# EAGLE schematic BOOSTDCDC_BATT (1) (EAGLE 9.5.2)
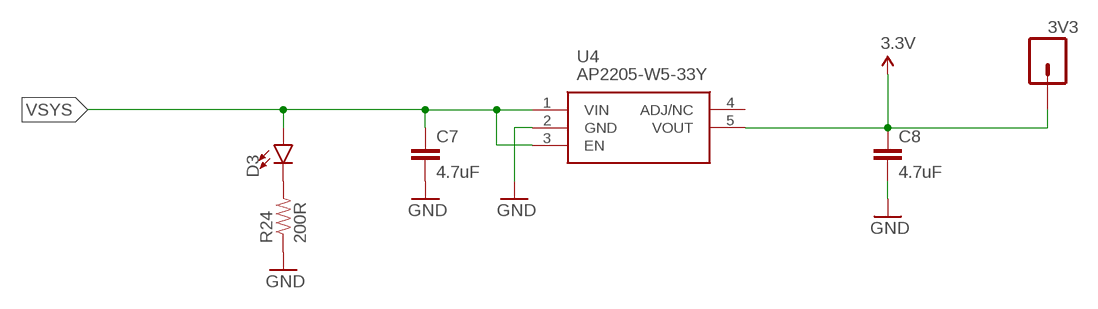
[diagram p0: schematic, sheet 1, part 1 of 3]
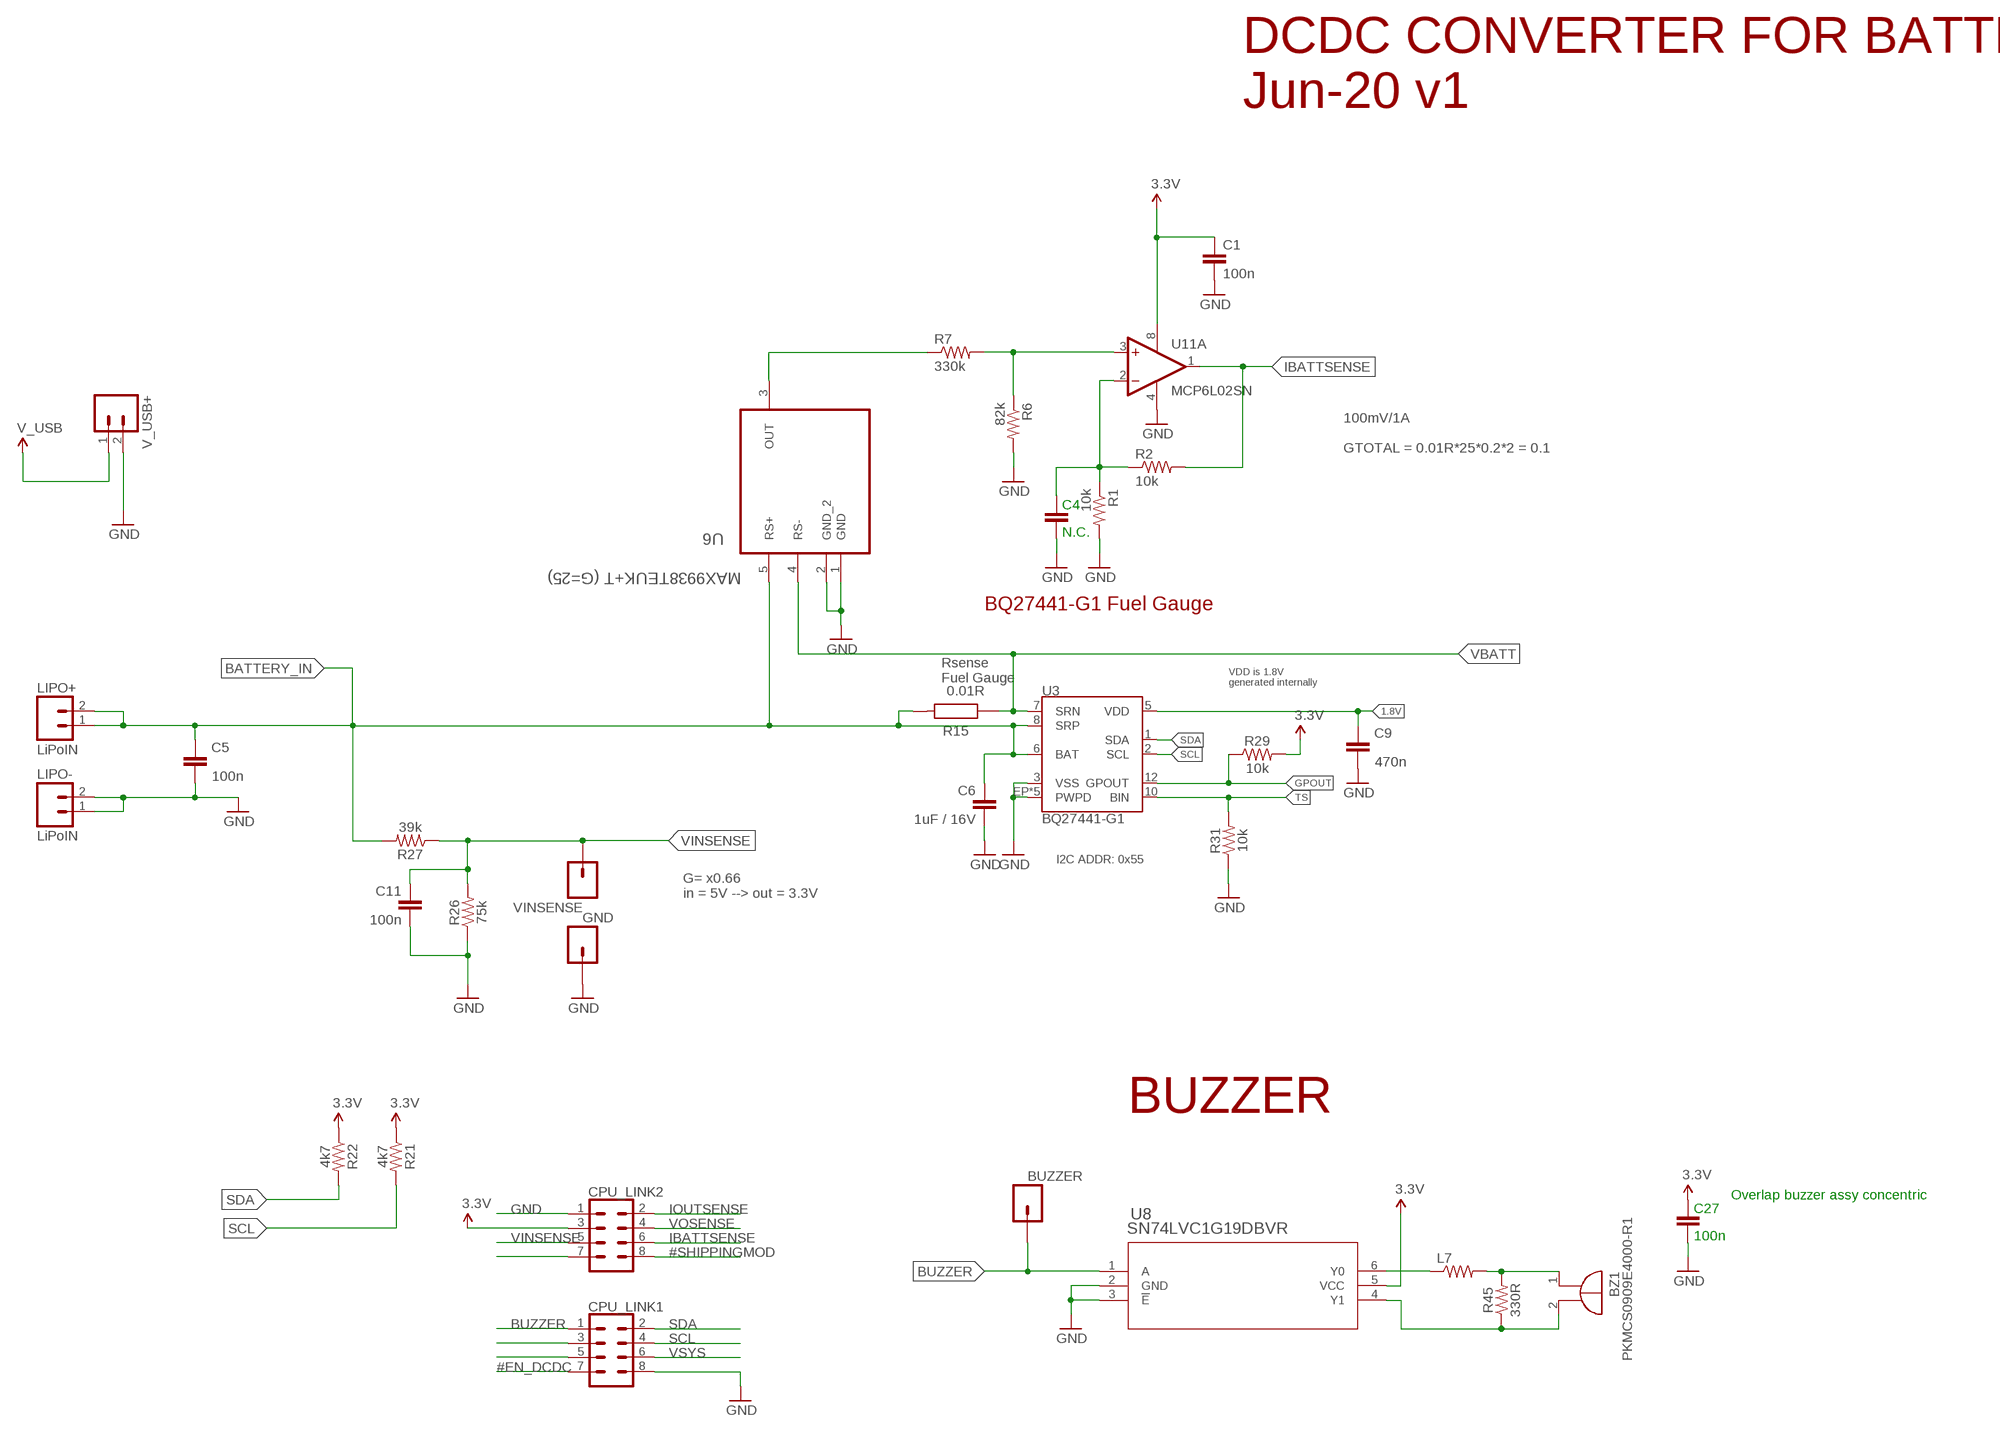
[diagram p1: schematic, sheet 1, part 2 of 3]
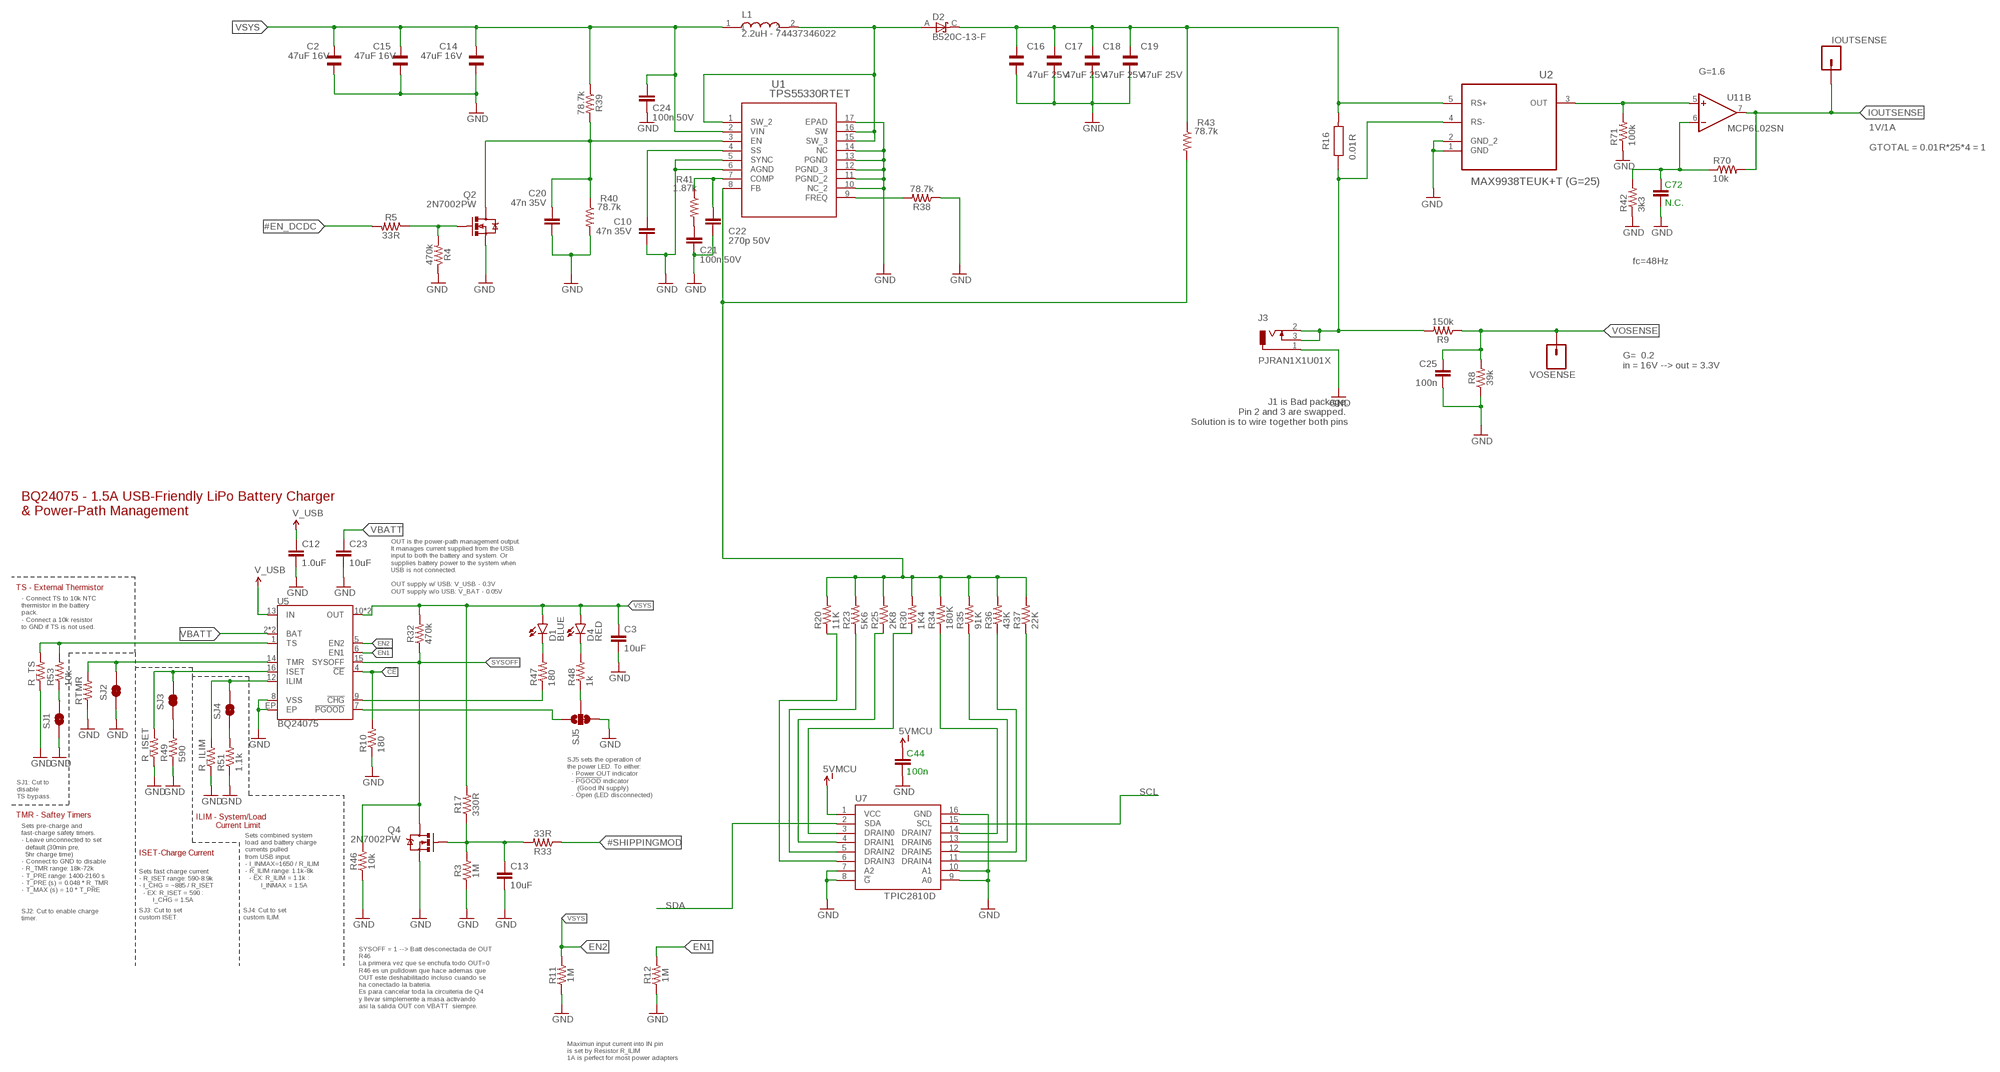
[diagram p2: schematic, sheet 1, part 3 of 3]

## Parts
3V3  M01PTH_2MM  [1X01_2MM]
BUZZER  M01PTH_2MM  [1X01_2MM]
BZ1  PKMCS0909E4000-R1  [PKMCS0909]
C1  100n  CAP0805  [0805]
C2  47uF 16V  WCAP-CSGP_1210_885012109003  [WCAP-CSGP_1210]
C3  10uF  10UF10V10%(0805)  [0805-CAP]
C4  N.C.  CAP0805  [0805]
C5  100n  10UF-0805-25V-10%  [0805@1]
C6  1uF / 16V  10UF-0805-25V-10%  [0805@1]
C7  4.7uF  CAPACITOR-N0805  [0805]
C8  4.7uF  CAPACITOR-N0805  [0805]
C9  470n  10UF-0805-25V-10%  [0805@1]
C10  47n 35V  10UF-0805-25V-10%  [0805@1]
C11  100n  10UF-0805-25V-10%  [0805@1]
C12  1.0uF  1.0UF50V10%(1206)  [1206-CAP]
C13  10uF  10UF10V10%(0805)  [0805-CAP]
C14  47uF 16V  WCAP-CSGP_1210_885012109003  [WCAP-CSGP_1210]
C15  47uF 16V  WCAP-CSGP_1210_885012109003  [WCAP-CSGP_1210]
C16  47uF 25V  WCAP-CSGP_1210_885012109003  [WCAP-CSGP_1210]
C17  47uF 25V  WCAP-CSGP_1210_885012109003  [WCAP-CSGP_1210]
C18  47uF 25V  WCAP-CSGP_1210_885012109003  [WCAP-CSGP_1210]
C19  47uF 25V  WCAP-CSGP_1210_885012109003  [WCAP-CSGP_1210]
C20  47n 35V  10UF-0805-25V-10%  [0805@1]
C21  100n 50V  10UF-0805-25V-10%  [0805@1]
C22  270p 50V  10UF-0805-25V-10%  [0805@1]
C23  10uF  10UF10V10%(0805)  [0805-CAP]
C24  100n 50V  10UF-0805-25V-10%  [0805@1]
C25  100n  10UF-0805-25V-10%  [0805@1]
C27  100n  CAP0805  [0805]
C44  100n  CAP0805  [0805]
C72  N.C.  CAP0805  [0805]
CPU_LINK1  CONN_04X2  [2X4]
CPU_LINK2  CONN_04X2  [2X4]
D1  BLUE  LED-BLUE0603  [LED-0603]
D2  B520C-13-F  [DIOM7959X250N]
D3  LED3MM  [LED_3MM]
D4  RED  LED-RED0603  [LED-0603]
GND  M01PTH_2MM  [1X01_2MM]
IOUTSENSE  M01PTH_2MM  [1X01_2MM]
J3  PJRAN1X1U01X  [PJRAN1X1U01X]
L1  2.2uH - 74437346022  74437349100  [INDM7366X500]
L7  MMZ2012Y202BT000  RESISTOR0805-RES  [0805]
LIPO+  LiPoIN  M02PTH  [1X02]
LIPO-  LiPoIN  M02PTH  [1X02]
Q2  2N7002PW  MOSFET-NCHANNEL2N7002PW  [SOT323]
Q4  2N7002PW  MOSFET-NCHANNEL2N7002PW  [SOT323]
R1  10k  RESISTOR0805-RES  [0805]
R2  10k  RESISTOR0805-RES  [0805]
R3  1M  RESISTOR0805  [0805]
R4  470k  RESISTOR0805  [0805]
R5  33R  RESISTOR0805  [0805]
R6  82k  RESISTOR0805-RES  [0805]
R7  330k  RESISTOR0805-RES  [0805]
R8  39k  RESISTOR0805  [0805]
R9  150k  RESISTOR0805  [0805]
R10  180  RESISTOR0805-RES  [0805]
R11  1M  RESISTOR0805  [0805]
R12  1M  RESISTOR0805  [0805]
R15  0.01R  WRIS-KWKH_0612_561070332051  [WRIS-KWKH_0612]
R16  0.01R  WRIS-KWKH_0612_561070332051  [WRIS-KWKH_0612]
R17  330R  RESISTOR0805  [0805]
R20  11K  RESISTOR0805-RES  [0805]
R21  4k7  RESISTOR0805  [0805]
R22  4k7  RESISTOR0805  [0805]
R23  5K6  RESISTOR0805-RES  [0805]
R24  200R  RESISTOR0805-RES  [0805]
R25  2K8  RESISTOR0805-RES  [0805]
R26  75k  RESISTOR0805  [0805]
R27  39k  RESISTOR0805  [0805]
R29  10k  RESISTOR0805  [0805]
R30  1K4  RESISTOR0805-RES  [0805]
R31  10k  RESISTOR0805  [0805]
R32  470k  RESISTOR0805  [0805]
R33  33R  RESISTOR0805  [0805]
R34  180K  RESISTOR0805-RES  [0805]
R35  91K  RESISTOR0805-RES  [0805]
R36  43K  RESISTOR0805-RES  [0805]
R37  22K  RESISTOR0805-RES  [0805]
R38  78.7k  RESISTOR0805  [0805]
R39  78.7k  RESISTOR0805  [0805]
R40  78.7k  RESISTOR0805  [0805]
R41  1.87k  RESISTOR0805  [0805]
R42  3k3  RESISTOR0805-RES  [0805]
R43  78.7k  RESISTOR0805  [0805]
R45  330R  RESISTOR0805  [0805]
R46  10k  RESISTOR0805  [0805]
R47  180  RESISTOR0805-RES  [0805]
R48  1k  RESISTOR0805-RES  [0805]
R49  590  RESISTOR0805-RES  [0805]
R51  1.1k  RESISTOR0805-RES  [0805]
R53  10k  RESISTOR0805-RES  [0805]
R70  10k  RESISTOR0805-RES  [0805]
R71  100k  RESISTOR0805-RES  [0805]
R_ILIM  RESISTOR0805-RES  [0805]
R_ISET  RESISTOR0805-RES  [0805]
R_TS  RESISTOR0805-RES  [0805]
RTMR  RESISTOR0805-RES  [0805]
SJ1  JUMPER-PAD-2-NC_BY_TRACE  [PAD-JUMPER-2-NC_BY_TRACE_YES_SILK]
SJ2  JUMPER-PAD-2-NC_BY_TRACE  [PAD-JUMPER-2-NC_BY_TRACE_YES_SILK]
SJ3  JUMPER-PAD-2-NC_BY_TRACE  [PAD-JUMPER-2-NC_BY_TRACE_YES_SILK]
SJ4  JUMPER-PAD-2-NC_BY_TRACE  [PAD-JUMPER-2-NC_BY_TRACE_YES_SILK]
SJ5  JUMPER-PAD-3-2OF3_NC_BY_TRACE_SMALL  [PAD-JUMPER-3-2OF3_NC_BY_TRACE_YES_SILK_FULL_BOX]
U1  TPS55330RTET  [RTE16_1P66X1P66_TEX]
U2  MAX9938TEUK+T (G=25)  MAX9938FEUK+T  [SOT95P280X145-5N]
U3  BQ27441-G1  [PDSO-N12]
U4  AP2205-W5-33Y  AP2205-W5-7  [SOT95P282X145-5N]
U5  BQ24075  [PVQFN-N16]
U6  MAX9938TEUK+T (G=25)  MAX9938FEUK+T  [SOT95P280X145-5N]
U7  TPIC2810D  [SO16]
U8  SN74LVC1G19DBVR  [DBV6]
U11  MCP6L02SN  [SO08]
V_USB+  M02PTH  [1X02]
VINSENSE  M01PTH_2MM  [1X01_2MM]
VOSENSE  M01PTH_2MM  [1X01_2MM]

## Nets
1.8V: C9.1 U3.5(VDD)
3.3V: 3V3.1 C1.1 C8.1 C27.2 CPU_LINK2.3 R21.1 R22.1 R29.2 U4.5(VOUT) U8.5(VCC) U11.8(P:V+)
!CE!: R10.2 U5.4(!CE!)
!CHG!: R47.1 U5.9(!CHG!)
!PGOOD!: SJ5.1 U5.7(!PGOOD!)
#EN_DCDC: CPU_LINK1.7 R5.2
#SHIPPINGMOD: CPU_LINK2.8 R33.1
BATTERY_IN: C5.1 C6.1 LIPO+.1 LIPO+.2 R15.2 R27.2 U3.6(BAT) U3.8(SRP) U6.5(RS+)
BUZZER: BUZZER.1 CPU_LINK1.1 U8.1(A)
EN1: R12.2 U5.6(EN1)
EN2: R11.2 U5.5(EN2)
GND: C1.2 C2.1 C3.2 C4.1 C5.2 C6.2 C7.2 C8.2 C9.2 C10.2 C11.2 C12.2 C13.2 C14.1 C15.1 C16.1 C17.1 C18.1 C19.1 C20.2 C21.1 C22.1 C23.2 C24.1 C25.2 C27.1 C44.1 C72.1 CPU_LINK1.8 CPU_LINK2.1 GND.1 J3.1 LIPO-.1 LIPO-.2 Q2.2(S) Q4.2(S) R1.2 R3.1 R4.1 R6.2 R8.1 R10.1 R11.1 R12.1 R24.1 R26.1 R31.1 R38.1 R40.2 R42.1 R46.1 R49.1 R51.1 R71.1 R_ILIM.1 R_ISET.1 R_TS.1 RTMR.1 SJ1.1 SJ2.1 SJ5.3 U1.5(SYNC) U1.6(AGND) U1.10(NC_2) U1.11(PGND_2) U1.12(PGND_3) U1.13(PGND) U1.14(NC) U1.17(EPAD) U2.1(GND) U2.2(GND_2) U3.3(VSS) U3.EP1(PWPD) U3.EP2(PWPD) U3.EP3(PWPD) U3.EP4(PWPD) U3.EP(PWPD) U4.2(GND) U5.8(VSS) U5.EP U6.1(GND) U6.2(GND_2) U7.7(A2) U7.8(!G) U7.9(A0) U7.10(A1) U7.16(GND) U8.2(GND) U8.3(!E) U11.4(P:V-) V_USB+.2
GPOUT: R29.1 U3.12(GPOUT)
IBATTSENSE: CPU_LINK2.6 R2.2 U11.1(A:OUT)
ILIM: R_ILIM.2 SJ4.2 U5.12(ILIM)
IOUTSENSE: CPU_LINK2.2 IOUTSENSE.1 R70.2 U11.7(B:OUT)
ISET: R_ISET.2 SJ3.2 U5.16(ISET)
N$1: D4.C R48.2
N$2: CPU_LINK2.7
N$3: CPU_LINK1.3
N$4: Q2.1(G) R4.2 R5.1
N$5: CPU_LINK1.5
N$6: D1.C R47.2
N$7: R53.1 SJ1.2
N$8: R71.2 U2.3(OUT) U11.5(B:+IN)
N$9: R51.2 SJ4.1
N$10: C4.2 R1.1 R2.1 U11.2(A:-IN)
N$11: R6.1 R7.2 U11.3(A:+IN)
N$13: J3.2 J3.3 R9.2 R16.1 U2.4(RS-)
N$14: R49.2 SJ3.1
N$15: R48.1 SJ5.2
N$16: R20.1 U7.6(DRAIN3)
N$17: L7.1 U8.6(Y0)
N$18: D3.K(C) R24.2
N$19: BZ1.1(+) L7.2 R45.2
N$21: R23.1 U7.5(DRAIN2)
N$22: BZ1.2(-) R45.1 U8.4(Y1)
N$23: C13.1 Q4.1(G) R3.2 R17.1 R33.2
N$24: R25.1 U7.4(DRAIN1)
N$30: R30.1 U7.3(DRAIN0)
N$31: R34.1 U7.14(DRAIN7)
N$32: R35.1 U7.13(DRAIN6)
N$33: R36.1 U7.12(DRAIN5)
N$34: R37.1 U7.11(DRAIN4)
N$35: C10.1 U1.4(SS)
N$36: D2.A L1.2 U1.1(SW_2) U1.15(SW_3) U1.16(SW)
N$37: R38.2 U1.9(FREQ)
N$42: C20.1 Q2.3(D) R39.2 R40.1 U1.3(EN)
N$43: C21.2 R41.2
N$44: C22.2 R41.1 U1.7(COMP)
N$45: R20.2 R23.2 R25.2 R30.2 R34.2 R35.2 R36.2 R37.2 R43.2 U1.8(FB)
N$46: R7.1 U6.3(OUT)
N$77: C72.2 R42.2 R70.1 U11.6(B:-IN)
SCL: CPU_LINK1.4 R21.2 U3.2(SCL) U7.15(SCL)
SDA: CPU_LINK1.2 R22.2 U3.1(SDA) U7.2(SDA)
SYSOFF: Q4.3(D) R32.1 R46.2 U5.15(SYSOFF)
TMR: RTMR.2 SJ2.2 U5.14(TMR)
TS: R31.2 U3.10(BIN)
TS1: R53.2 R_TS.2 U5.1(TS)
V_USB: C12.1 U5.13(IN) V_USB+.1
VBATT: C23.1 R15.1 U3.7(SRN) U5.2(BAT) U5.3(BAT) U6.4(RS-)
VCC-ISO: C44.2 U7.1(VCC) ; supply symbol labelled 5VMCU
VINSENSE: C11.1 CPU_LINK2.5 R26.2 R27.1 VINSENSE.1
VOSENSE: C25.1 CPU_LINK2.4 R8.2 R9.1 VOSENSE.1
VSOURCE: C16.2 C17.2 C18.2 C19.2 D2.C R16.2 R43.1 U2.5(RS+)
VSYS: C2.2 C3.1 C7.1 C14.2 C15.2 C24.2 CPU_LINK1.6 D1.A D3.A D4.A L1.1 R17.2 R32.2 R39.1 U1.2(VIN) U4.1(VIN) U4.3(EN) U5.10(OUT) U5.11(OUT)
Unconnected: U4.4(ADJ/NC)

## Notes on the sheet
- DCDC CONVERTER FOR BATTERY
  Jun-20 v1
- 100mV/1A
  
  GTOTAL = 0.01R*25*0.2*2 = 0.1
- BQ27441-G1 Fuel Gauge
- VDD is 1.8V
  generated internally
- Rsense
  Fuel Gauge
- I2C ADDR: 0x55
- G= x0.66
  in = 5V --> out = 3.3V
- BUZZER
- Overlap buzzer assy concentric
- G=1.6
- 1V/1A
  
  GTOTAL = 0.01R*25*4 = 1
- fc=48Hz
- G=  0.2
  in = 16V --> out = 3.3V
- J1 is Bad package.
  Pin 2 and 3 are swapped. 
  Solution is to wire together both pins
- BQ24075 - 1.5A USB-Friendly LiPo Battery Charger 
  & Power-Path Management
- OUT is the power-path management output.
  It manages current supplied from the USB 
  input to both the battery and system. Or
  supplies battery power to the system when 
  USB is not connected.
  
  OUT supply w/ USB: V_USB - 0.3V
  OUT supply w/o USB: V_BAT - 0.05V
- TS - External Thermistor
- - Connect TS to 10k NTC 
  thermistor in the battery
  pack.
  - Connect a 10k resistor 
  to GND if TS is not used.
- SJ5 sets the operation of 
  the power LED. To either:
    - Power OUT indicator
    - !PGOOD! indicator 
       (Good IN supply)
    - Open (LED disconnected)
- SJ1: Cut to 
  disable
  TS bypass.
- TMR - Saftey Timers
- ILIM - System/Load 
            Current Limit
- Sets pre-charge and
  fast-charge safety timers.
  - Leave unconnected to set
    default (30min pre, 
    5hr charge time)
  - Connect to GND to disable
  - R_TMR range: 18k-72k
  - T_PRE range: 1400-2160 s
  - T_PRE (s) = 0.048 * R_TMR
  - T_MAX (s) = 10 * T_PRE
- Sets combined system
  load and battery charge 
  currents pulled
  from USB input.
  - I_INMAX=1650 / R_ILIM
  - R_ILIM range: 1.1k-8k
    - EX: R_ILIM = 1.1k : 
          I_INMAX = 1.5A
- ISET-Charge Current
- Sets fast charge current
  - R_ISET range: 590-8.9k
  - I_CHG = ~885 / R_ISET
    - EX: R_ISET = 590 : 
         I_CHG = 1.5A
- SJ3: Cut to set
  custom ISET.
- SJ4: Cut to set
  custom ILIM.
- SJ2: Cut to enable charge
  timer.
- SYSOFF = 1 --> Batt desconectada de OUT
  R46
  La primera vez que se enchufa todo OUT=0
  R46 es un pulldown que hace ademas que
  OUT este deshabilitado incluso cuando se
  ha conectado la bateria.
  Es para cancelar toda la circuiteria de Q4
  y llevar simplemente a masa activando
  asi la salida OUT con VBATT  siempre.
- Maximun input current into IN pin
  is set by Resistor R_ILIM
  1A is perfect for most power adapters

## Library data of the parts
3V3 BUZZER GND IOUTSENSE VINSENSE VOSENSE = SparkFun-Connectors:M01: Header 1 Standard 1-pin 0.1" header. Use with straight break away headers (SKU : PRT-00116), right angle break away headers (PRT-00553), swiss pins (PRT-00743), machine pins (PRT-00117), and female headers (PRT-00115).
BZ1 = buzzer:PKMCS0909E4000-R1: PKMCS0909E4000-R1 Source : http://www.murata.com/~/media/webrenewal/products/sound/sounder/vppt-buzj083-d.ashx
C1 = SparkFun-Passives:CAP: Capacitor Standard 0603 ceramic capacitor, and 0.1" leaded capacitor.
C2 C14-C19 = Wurth_Elektronik_Passive_Capacitors_rev19a:WCAP-CSGP_1210: WCAP-CSGP Ceramic Capacitors Characteristics Multilayer Ceramic Chip Capacitor Recommended soldering:Reflow, for 0603 and 0805 wave soldering is also allowed Operating temperature:-55 °C to +125 °C; Ceramic characteristics: Class I - NPO ; Class II -X7R, X5R High performance ceramic High capacitance stability Minimal aging Termination:Cu/Ni/Sn <http://katalog.we-online.de/media/images/eisos/WCAP-CSGP_pf2.jpg> Details see: http://katalog.we-online.de/en/pbs/WCAP-CSGP-1210? Created: 2015-01-28 2015 (C) Wurth Elektronik; WE-NUMBER: 885012109003/47uF
C3 C13 C23 = SparkFun-Capacitors:10UF10V10%(0805): CAP-11330; PROD_ID: CAP-11330
C4 C27 C44 C72 = SparkFun:CAP: Capacitor Standard 0603 ceramic capacitor, and 0.1" leaded capacitor.
C5 C6 C9-C11 C20-C22 C24 C25 = SparkFun-Capacitors:10UF: 10.0µF ceramic capacitors A capacitor is a passive two-terminal electrical component used to store electrical energy temporarily in an electric field.; PROD_ID: CAP-14259; VALUE: 10uF
C7 C8 = BeagleBone_Blue_R3:CAPACITOR-N
C12 = SparkFun-Capacitors:1.0UF50V10%(1206): CAP-09822; PROD_ID: CAP-09822
CPU_LINK1 CPU_LINK2 = SparkFun-Connectors:CONN_04X2: Multi connection point. Often used as Generic Header-pin footprint for 0.1 inch spaced/style header connections On any of the 0.1 inch spaced packages, you can populate with these: Break Away Headers - Straight <https://www.sparkfun.com/products/116> (PRT-00116) Break Away Male Headers - Right Angle <https://www.sparkfun.com/products/553> (PRT-00553) Female Headers <https://www.sparkfun.com/products/115> (PRT-00115) Break Away Headers - Machine Pin <https://www.sparkfun.com/products/117> (PRT-00117) Break Away Female Headers - Swiss Machine Pin <https://www.sparkfun.com/products/743> (PRT-00743)
D1 = SparkFun-LED:LED-BLUE: Blue LEDs for production use Various blue LEDs stocked by SparkFun production 0603 - DIO-08575 Rebel - DIO-09553 1206 - DIO-09911; PROD_ID: DIO-08575
D2 = B520C-13-F:B520C-13-F: 5.0A SURFACE MOUNT SCHOTTKY BARRIER RECTIFIER; AVAILABILITY: Unavailable; DESCRIPTION: Diode Schottky 20V 5A Surface Mount SMC; DIGIKEY-PURCHASE-URL: https://snapeda.com/shop?store=DigiKey&id=325969; MF: Diodes Inc.; MP: B520C-13-F; PACKAGE: DO-214 Diodes Inc.; PRICE: None
D3 = SparkFun-LED:LED: LED (Generic) Standard schematic elements and footprints for 5mm, 3mm, 1206, and 0603 sized LEDs. Generic LEDs with no color specified.; PROD_ID: DIO-08794
D4 = SparkFun-LED:LED-RED: Assorted Red LEDs LilyPad 1206- DIO-09912 1206- DIO-00809 0603- DIO-00819 "SMART" means more efficient and expensive; PROD_ID: DIO-00819
J3 = Connectors:PJRAN1X1U01X: CONN RCA JACK MONO 3.2MM R/A Manufacturer's datasheet <http://www.switchcraft.com/Drawings/pjran1x1u__x_series_cd.pdf>; CREATED_BY: PCBLayout.com; DIGIKEY_PART_NUMBER: PJRAN1X1U01X-ND; MANUFACTURER: Switchcraft Inc.; MPN: PJRAN1X1U01X
L1 = Inductance_2.2uH:74437349100: Inductor, SMD [Würth Elektronik] 74437349100 Inductor, SMD; DESCRIPTION: 10µH Shielded Molded Inductor 3.2A 69mOhm Max Nonstandard; DIGIKEY-PURCHASE-URL: https://snapeda.com/shop?store=DigiKey&id=586788; MF: Wurth Electronics; MP: 74437349100; PACKAGE: Nonstandard Wurth Electronics
L7 R10 R20 R23-R25 R30 R34-R37 R42 R47-R49 R51 R53 R70 R71 R_ILIM R_ISET R_TS RTMR = SparkFun:RESISTOR: Resistor Basic schematic elements and footprints for 0603, 1206, and PTH resistors.
LIPO+ LIPO- V_USB+ = SparkFun:M02: Header 2 Standard 2-pin 0.1" header. Use with straight break away headers (SKU : PRT-00116), right angle break away headers (PRT-00553), swiss pins (PRT-00743), machine pins (PRT-00117), and female headers (PRT-00115). Molex polarized connector foot print use with SKU : PRT-08233 with associated crimp pins and housings.
Q2 Q4 = SparkFun-DiscreteSemi:MOSFET-NCHANNEL: Common NMOSFET Parts MFG P/N Store ID Prod ID FDD8780 TRANS-09984 SI7820DN TRANS-11055 FDS6630A IC-08089 2N7002PW TRANS-11151 FQP30N06L COM-10213 TRANS-10060 BSS123LT1G TRANS-08345 BSS138 TRANS-00830 BS170 2N7000; PROD_ID: TRANS-11151
R1 R2 R6 R7 = SparkFun-Passives:RESISTOR: Resistor Basic schematic elements and footprints for 0603, 1206, and PTH resistors.
R3-R5 R8 R9 R11 R12 R17 R21 R22 R26 R27 R29 R31-R33 R38-R41 R43 R45 R46 = SparkFun-Resistors:RESISTOR: Generic Resistor Package
R15 R16 = Wurth_Resistor_WRIS-KWKH:WRIS-KWKH_0612: WRIS-KWKH Thick Film Resistors High Power Current Sensing, Wide Terminal Characteristics Product series for high power current sensing up to 1 W Mounting style: SMT-Chip (wide terminal) Resistance range: 100 mΩ ‒ 620 Ω Resistance tolerance: ±1% / ±5% Rated Power: 1 W TCR: +200; +250; +350 ppm/°C Operating temperature: -55 °C up to +155 °C Sizes: 0612 / 1020 Recommended soldering: Reflow soldering Applications DC/DC converter Camera Night vision device TV Lighting <https://katalog.we-online.com/media/images/v2/o135742v209%20Family_WRIS-KWKH.jpg> Details see: https://katalog.we-online.com/en/pbs/WRIS-KWKH Created by Ella Wu 2019-09-06 2019(C) Wurth Elektronik; DATASHEET-URL: https://katalog.we-online.de/pbs/datasheet/561070332051.pdf; IR: 3.2A; MOUNT: SMT; PART-NUMBER: 561070332051; PRATED: 1W; TCR: 350ppm/ °C; TECHNICAL-REFERENCE: KH0612R100F101QAATP0000; VALUE: 100mOhm
SJ1-SJ4 = SparkFun-Passives:JUMPER-PAD-2-NC_BY_TRACE
SJ5 = SparkFun-Passives:JUMPER-PAD-3-2OF3_NC_BY_TRACE
U1 = TPS55330:TPS55330RTET; BUILT_BY: EMA_UL_Team; MANUFACTURER_PART_NUMBER: TPS55330RTET; SOURCELIBRARY: TI_2015-1-5; VENDOR: Texas Instruments
U2 U6 = MAX9938:MAX9938FEUK+T; DESCRIPTION: Precision Current-Sense Amplifier; MPN: MAX9938FEUK+T; OC_FARNELL: -; OC_NEWARK: 01N6733; PACKAGE: SOT-23-5; SUPPLIER: Maxim
U3 = battery-management-temp:BQ27441-G1; PROD_ID: IC-13220
U4 = AP2205-W5-7:AP2205-W5-7: LDO Voltage Regulators LDO CMOS LowCurr Source: Datasheet <https://www.diodes.com/assets/Datasheets/AP2206.pdf>; DESCRIPTION: LDO Voltage Regulators LDO CMOS LowCurr; HEIGHT: 1.45mm; MANUFACTURER_NAME: Diodes Inc.; MANUFACTURER_PART_NUMBER: AP2205-W5-7; MOUSER_PART_NUMBER: 621-AP2205-W5-7; MOUSER_PRICE-STOCK: https://www.mouser.com/Search/Refine.aspx?Keyword=621-AP2205-W5-7
U5 = battery-management-temp:BQ24075; PROD_ID: IC-13219
U7 = EDCPSU - Rev2:TPIC2810D
U8 = SN74LVC1G19DBVR:SN74LVC1G19DBVR; DATASHEET_URL: http://www.ti.com/lit/gpn/SN74LVC1G19; DESCRIPTION: 1-of-2 Decoder/Demultiplexer; FAMILY_NAME: LL Decoder, Mux/Demux; GENERIC_PART_NUMBER: SN74LVC1G19; INDUSTRY_STD_PKG_TYPE: SOT-23; MANUFACTURER: Texas Instruments; MANUFACTURER_PART_NUMBER: SN74LVC1G19DBVR; PACKAGE_DESIGNATOR: DBV; PIN_COUNT: 6; VENDOR: Texas Instruments
U11 = EDCPSU_Rev4:MCP6L02: 1 MHz, 85 µA Op Amps http://ww1.microchip.com/downloads/en/devicedoc/22140b.pdf

## Net classes
2 gnd: width 0.305 mm, drill 0.483 mm, clearance 0.203 mm